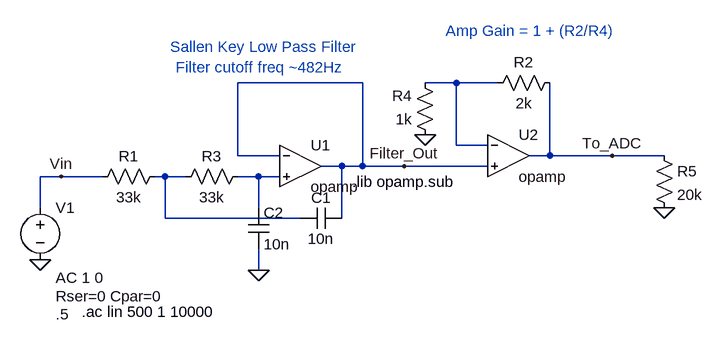
[diagram p0: schematic LPF_Active_Salen_Key.asc]
LPF_Active_Salen_Key.asc, the LTspice schematic file:
Version 4
SHEET 1 976 680
WIRE 448 -32 256 -32
WIRE 592 -32 544 -32
WIRE 656 -32 592 -32
WIRE 592 64 592 -32
WIRE 640 64 592 64
WIRE 256 80 256 -32
WIRE 320 80 256 80
WIRE 736 80 736 -32
WIRE 736 80 704 80
WIRE 832 80 736 80
WIRE 912 80 832 80
WIRE 416 96 384 96
WIRE 448 96 448 -32
WIRE 448 96 416 96
WIRE 512 96 448 96
WIRE 640 96 512 96
WIRE -16 112 -48 112
WIRE 48 112 -16 112
WIRE 144 112 128 112
WIRE 176 112 144 112
WIRE 288 112 256 112
WIRE 320 112 288 112
WIRE -48 160 -48 112
WIRE 288 160 288 112
WIRE 144 176 144 112
WIRE 352 176 144 176
WIRE 416 176 416 96
WIRE 288 256 288 224
FLAG 288 256 0
FLAG -48 240 0
FLAG 544 48 0
FLAG 912 160 0
FLAG 832 80 To_ADC
FLAG -16 112 Vin
FLAG 512 96 Filter_Out
SYMBOL cap 272 160 R0
SYMATTR InstName C2
SYMATTR Value 10n
SYMBOL voltage -48 144 R0
WINDOW 3 24 180 Left 2
WINDOW 123 24 124 Left 2
WINDOW 39 24 152 Left 2
SYMATTR Value .5
SYMATTR Value2 AC 1 0
SYMATTR SpiceLine Rser=0 Cpar=0
SYMATTR InstName V1
SYMBOL res 272 96 R90
WINDOW 0 0 56 VBottom 2
WINDOW 3 32 56 VTop 2
SYMATTR InstName R3
SYMATTR Value 33k
SYMBOL Opamps\\opamp 352 32 R0
SYMATTR InstName U1
SYMBOL res 144 96 R90
WINDOW 0 0 56 VBottom 2
WINDOW 3 32 56 VTop 2
SYMATTR InstName R1
SYMATTR Value 33k
SYMBOL cap 416 160 R90
WINDOW 0 0 32 VBottom 2
WINDOW 3 32 32 VTop 2
SYMATTR InstName C1
SYMATTR Value 10n
SYMBOL Opamps\\opamp 672 16 R0
SYMATTR InstName U2
SYMBOL res 752 -48 R90
WINDOW 0 0 56 VBottom 2
WINDOW 3 32 56 VTop 2
SYMATTR InstName R2
SYMATTR Value 2k
SYMBOL res 560 64 R180
WINDOW 0 36 76 Left 2
WINDOW 3 36 40 Left 2
SYMATTR InstName R4
SYMATTR Value 1k
SYMBOL res 896 64 R0
SYMATTR InstName R5
SYMATTR Value 20k
TEXT 16 320 Left 2 !.ac lin 500 1 10000
TEXT 432 120 Left 2 !.lib opamp.sub
TEXT 576 -112 Left 2 ;Amp Gain = 1 + (R2/R4)
TEXT 160 -56 Left 2 ;Filter cutoff freq ~482Hz
TEXT 152 -88 Left 2 ;Sallen Key Low Pass Filter

The netlist it stands for:
* LPF_Active_Salen_Key.asc
C2 N003 0 10n
V1 Vin 0 .5 AC 1 0 Rser=0 Cpar=0
R3 N003 N002 33k
XU1 Filter_Out N003 Filter_Out opamp Aol=100K GBW=10Meg  ; pins invin noninvin out
R1 N002 Vin 33k
C1 Filter_Out N002 10n
XU2 N001 Filter_Out To_ADC opamp Aol=100K GBW=10Meg  ; pins invin noninvin out
R2 To_ADC N001 2k
R4 0 N001 1k
R5 To_ADC 0 20k
.ac lin 500 1 10000
.lib opamp.sub
* Amp Gain = 1 + (R2/R4)
* Filter cutoff freq ~482Hz
* Sallen Key Low Pass Filter
.backanno
.end